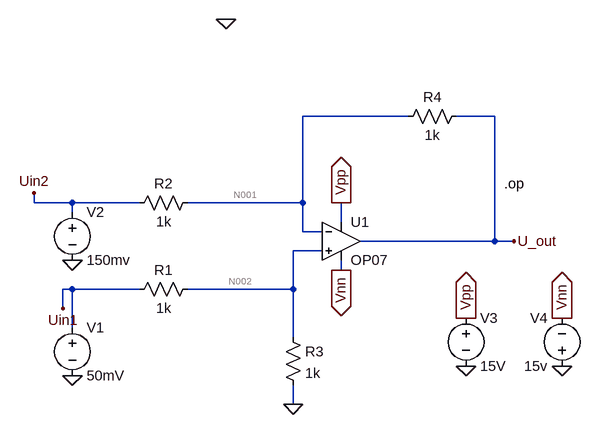
[diagram p0: schematic Subtractor.asc]
Subtractor.asc, the LTspice schematic file:
Version 4
SHEET 1 880 680
WIRE 480 -192 304 -192
WIRE 624 -192 560 -192
WIRE -144 -48 -144 -64
WIRE -80 -48 -144 -48
WIRE 32 -48 -80 -48
WIRE 304 -48 304 -192
WIRE 304 -48 112 -48
WIRE -80 -32 -80 -48
WIRE 368 -16 368 -48
WIRE 304 0 304 -48
WIRE 336 0 304 0
WIRE 624 16 624 -192
WIRE 624 16 400 16
WIRE 656 16 624 16
WIRE 336 32 288 32
WIRE 368 64 368 48
WIRE -80 96 -96 96
WIRE 32 96 -80 96
WIRE 288 96 288 32
WIRE 288 96 112 96
WIRE -96 128 -96 96
WIRE -80 160 -80 96
WIRE 288 176 288 96
WIRE 288 288 288 256
FLAG -80 48 0
FLAG -80 240 0
FLAG 288 288 0
FLAG 176 -3424 0
FLAG 656 16 U_out
FLAG -96 128 Uin1
FLAG -144 -64 Uin2
FLAG 576 144 Vpp
IOPIN 576 144 Out
FLAG 576 224 0
FLAG 736 144 Vnn
IOPIN 736 144 Out
FLAG 736 224 0
FLAG 368 -48 Vpp
IOPIN 368 -48 Out
FLAG 368 64 Vnn
IOPIN 368 64 Out
SYMBOL res 128 -64 R90
WINDOW 0 0 56 VBottom 2
WINDOW 3 32 56 VTop 2
SYMATTR InstName R2
SYMATTR Value 1k
SYMBOL res 128 80 R90
WINDOW 0 0 56 VBottom 2
WINDOW 3 32 56 VTop 2
SYMATTR InstName R1
SYMATTR Value 1k
SYMBOL res 272 160 R0
SYMATTR InstName R3
SYMATTR Value 1k
SYMBOL voltage -80 144 R0
WINDOW 123 0 0 Left 0
WINDOW 39 0 0 Left 0
SYMATTR InstName V1
SYMATTR Value 50mV
SYMBOL voltage -80 -48 R0
WINDOW 123 0 0 Left 0
WINDOW 39 0 0 Left 0
SYMATTR InstName V2
SYMATTR Value 150mv
SYMBOL OpAmps\\OP07 368 -48 R0
SYMATTR InstName U1
SYMBOL res 576 -208 R90
WINDOW 0 0 56 VBottom 2
WINDOW 3 32 56 VTop 2
SYMATTR InstName R4
SYMATTR Value 1k
SYMBOL voltage 576 128 R0
SYMATTR InstName V3
SYMATTR Value 15V
SYMBOL voltage 736 240 R180
WINDOW 0 24 96 Left 2
WINDOW 3 24 16 Left 2
SYMATTR InstName V4
SYMATTR Value 15v
TEXT 640 -80 Left 2 !.op

The netlist it stands for:
* Subtractor.asc
R2 N001 Uin2 1k
R1 N002 Uin1 1k
R3 N002 0 1k
V1 Uin1 0 50mV
V2 Uin2 0 150mv
XU1 N002 N001 Vpp Vnn U_out LT1001  ; OP07, pins In+ In- V+ V- OUT
R4 U_out N001 1k
V3 Vpp 0 15V
V4 0 Vnn 15v
.op
.lib LTC.lib
.backanno
.end

* Results of the author's LTspice run, read from the files saved beside the schematic
* Operating Point:
*   V(n001) = 25 mV
*   V(uin2) = 150 mV
*   V(n002) = 25 mV
*   V(uin1) = 50 mV
*   V(vpp) = 15 V
*   V(vnn) = -15 V
*   V(u_out) = -100 mV
*   I(R4) = -125 µA
*   I(R3) = 25 µA
*   I(R1) = -25 µA
*   I(R2) = -125 µA
*   I(V4) = -2.313 mA
*   I(V3) = -2.188 mA
*   I(V2) = -125 µA
*   I(V1) = -25 µA
*   Ix(u1:1) = 42.76 fA
*   Ix(u1:2) = 46.53 fA
*   Ix(u1:3) = 2.188 mA
*   Ix(u1:4) = -2.313 mA
*   Ix(u1:5) = 125 µA
* From the log:
*   Semiconductor Device Operating Points:
*                           --- Diodes ---
*   Name:    d:u1:4      d:u1:1
*   Model:    u1:di       u1:x
*   Id:      1.40e-16    4.17e-15
*   Vd:      1.40e-07    4.17e-03
*   Req:     1.00e-09    1.00e-12
*   CAP:     0.00e+00    0.00e+00
*                           --- VDMOSFET Transistors ---
*   Name:        m:u1:2      m:u1:1
*   Model:        u1:p        u1:n
*   Id:         -2.31e-03    2.19e-03
*   Vgs:        -4.17e-03   -4.17e-03
*   Vds:        -1.49e+01    1.51e+01
*   Vth:         3.00e-01   -3.00e-01
*   Gm:          1.52e-02    1.48e-02
*   Gds:         0.00e+00    0.00e+00
*   Cgs:         0.00e+00    0.00e+00
*   Cgd:         0.00e+00    0.00e+00
*   Cbody:       0.00e+00    0.00e+00